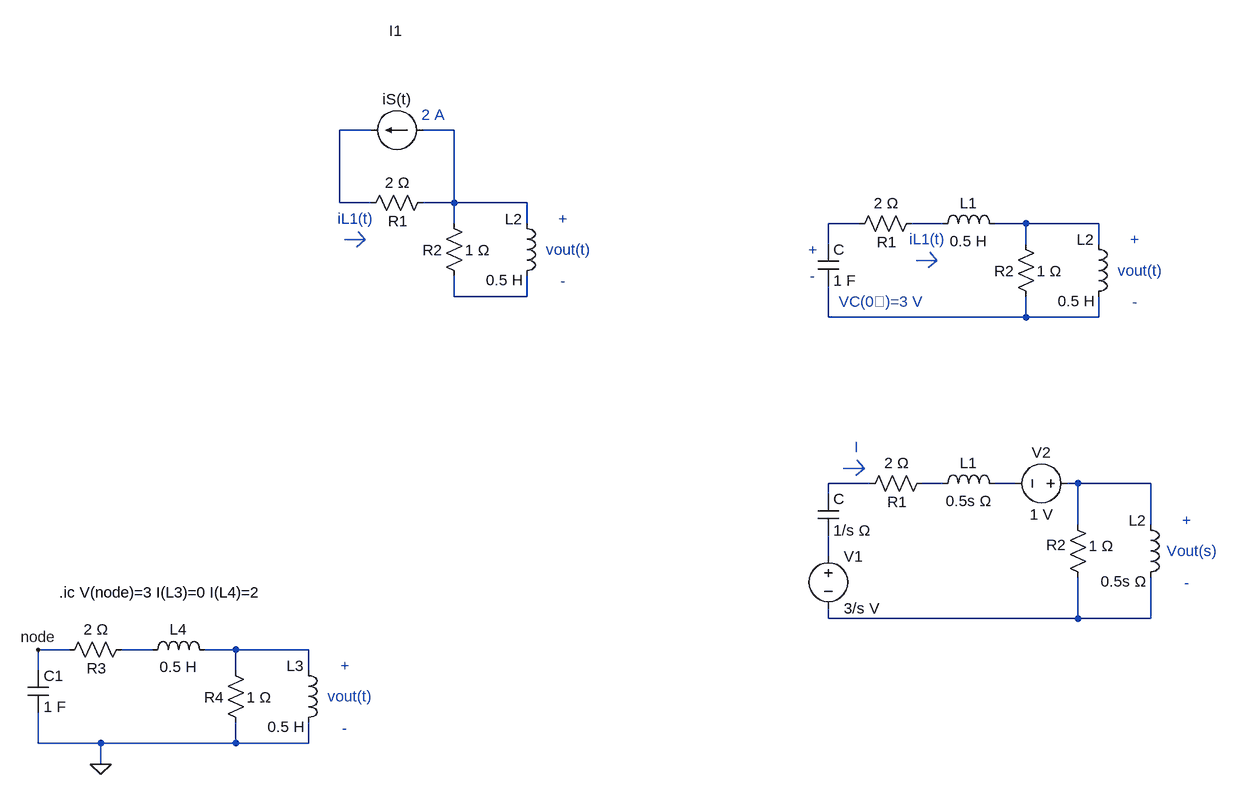
[diagram p0: schematic ELE228-2.asc]
ELE228-2.asc, the LTspice schematic file:
Version 4.1
SHEET 1 1548 1108
WIRE 240 112 192 112
WIRE 368 112 320 112
WIRE 192 224 192 112
WIRE 240 224 192 224
WIRE 368 224 368 112
WIRE 368 224 320 224
WIRE 480 224 368 224
WIRE 368 256 368 224
WIRE 480 256 480 224
WIRE 992 256 944 256
WIRE 1120 256 1072 256
WIRE 1248 256 1200 256
WIRE 1360 256 1248 256
WIRE 944 288 944 256
WIRE 1248 288 1248 256
WIRE 1360 288 1360 256
WIRE 368 368 368 336
WIRE 480 368 480 336
WIRE 480 368 368 368
WIRE 944 400 944 352
WIRE 1248 400 1248 368
WIRE 1248 400 944 400
WIRE 1360 400 1360 368
WIRE 1360 400 1248 400
WIRE 1008 656 944 656
WIRE 1120 656 1088 656
WIRE 1232 656 1200 656
WIRE 1328 656 1312 656
WIRE 1440 656 1328 656
WIRE 944 672 944 656
WIRE 1328 720 1328 656
WIRE 1440 720 1440 656
WIRE 944 768 944 736
WIRE 944 864 944 848
WIRE 1328 864 1328 800
WIRE 1328 864 944 864
WIRE 1440 864 1440 800
WIRE 1440 864 1328 864
WIRE -224 912 -272 912
WIRE -96 912 -144 912
WIRE 32 912 -16 912
WIRE 144 912 32 912
WIRE -272 944 -272 912
WIRE 32 944 32 912
WIRE 144 944 144 912
WIRE -272 1056 -272 1008
WIRE -176 1056 -272 1056
WIRE 32 1056 32 1024
WIRE 32 1056 -176 1056
WIRE 144 1056 144 1024
WIRE 144 1056 32 1056
WIRE -176 1088 -176 1056
FLAG -176 1088 0
FLAG -272 912 node
SYMBOL current 320 112 R90
WINDOW 0 -137 42 VBottom 2
WINDOW 3 -63 40 VTop 2
SYMATTR InstName I1
SYMATTR Value iS(t)
SYMBOL res 336 208 R90
WINDOW 0 60 54 VBottom 2
WINDOW 3 -31 55 VTop 2
SYMATTR InstName R1
SYMATTR Value 2 Ω
SYMBOL res 352 240 R0
WINDOW 0 -33 57 Left 2
WINDOW 3 71 57 Right 2
SYMATTR InstName R2
SYMATTR Value 1 Ω
SYMBOL ind 464 240 R0
WINDOW 0 -18 9 Left 2
WINDOW 3 -47 103 Left 2
SYMATTR InstName L2
SYMATTR Value 0.5 H
SYMBOL res 1088 240 R90
WINDOW 0 60 54 VBottom 2
WINDOW 3 -31 55 VTop 2
SYMATTR InstName R1
SYMATTR Value 2 Ω
SYMBOL res 1232 272 R0
WINDOW 0 -33 57 Left 2
WINDOW 3 71 57 Right 2
SYMATTR InstName R2
SYMATTR Value 1 Ω
SYMBOL ind 1344 272 R0
WINDOW 0 -18 9 Left 2
WINDOW 3 -47 103 Left 2
SYMATTR InstName L2
SYMATTR Value 0.5 H
SYMBOL ind 1104 272 R270
WINDOW 0 32 56 VTop 2
WINDOW 3 5 56 VBottom 2
SYMATTR InstName L1
SYMATTR Value 0.5 H
SYMBOL cap 928 288 R0
SYMATTR InstName C
SYMATTR Value 1 F
SYMBOL res 1104 640 R90
WINDOW 0 60 54 VBottom 2
WINDOW 3 -31 55 VTop 2
SYMATTR InstName R1
SYMATTR Value 2 Ω
SYMBOL res 1312 704 R0
WINDOW 0 -33 47 Left 2
WINDOW 3 71 48 Right 2
SYMATTR InstName R2
SYMATTR Value 1 Ω
SYMBOL ind 1424 704 R0
WINDOW 0 -18 9 Left 2
WINDOW 3 -61 103 Left 2
SYMATTR InstName L2
SYMATTR Value 0.5s Ω
SYMBOL ind 1104 672 R270
WINDOW 0 32 56 VTop 2
WINDOW 3 5 56 VBottom 2
SYMATTR InstName L1
SYMATTR Value 0.5s Ω
SYMBOL cap 928 672 R0
SYMATTR InstName C
SYMATTR Value 1/s Ω
SYMBOL voltage 944 752 R0
SYMATTR InstName V1
SYMATTR Value 3/s V
SYMBOL voltage 1328 656 R90
WINDOW 0 -32 56 VBottom 2
WINDOW 3 32 56 VTop 2
SYMATTR InstName V2
SYMATTR Value 1 V
SYMBOL res -128 896 R90
WINDOW 0 60 54 VBottom 2
WINDOW 3 -31 55 VTop 2
SYMATTR InstName R3
SYMATTR Value 2 Ω
SYMBOL res 16 928 R0
WINDOW 0 -33 57 Left 2
WINDOW 3 71 57 Right 2
SYMATTR InstName R4
SYMATTR Value 1 Ω
SYMBOL ind 128 928 R0
WINDOW 0 -18 9 Left 2
WINDOW 3 -47 103 Left 2
SYMATTR InstName L3
SYMATTR Value 0.5 H
SYMBOL ind -112 928 R270
WINDOW 0 32 56 VTop 2
WINDOW 3 5 56 VBottom 2
SYMATTR InstName L4
SYMATTR Value 0.5 H
SYMBOL cap -288 944 R0
SYMATTR InstName C1
SYMATTR Value 1 F
TEXT 216 248 Center 2 ;iL1(t)
TEXT 336 88 Center 2 ;2 A
TEXT 536 248 Center 2 ;+
TEXT 536 344 Center 2 ;-
TEXT 544 296 Center 2 ;vout(t)
TEXT 1096 280 Center 2 ;iL1(t)
TEXT 1416 280 Center 2 ;+
TEXT 1416 376 Center 2 ;-
TEXT 1424 328 Center 2 ;vout(t)
TEXT 960 376 Left 2 ;VC(0⁻)=3 V
TEXT 920 296 Center 2 ;+
TEXT 920 336 Center 2 ;-
TEXT 1496 712 Center 2 ;+
TEXT 1496 808 Center 2 ;-
TEXT 1504 760 Center 2 ;Vout(s)
TEXT 984 600 Left 2 ;I
TEXT 200 936 Center 2 ;+
TEXT 200 1032 Center 2 ;-
TEXT 208 984 Center 2 ;vout(t)
TEXT -240 824 Left 2 !.ic V(node)=3 I(L3)=0 I(L4)=2
LINE Normal 231 281 199 281
LINE Normal 220 268 231 281
LINE Normal 231 281 220 268
LINE Normal 231 281 218 292
LINE Normal 1111 313 1079 313
LINE Normal 1100 300 1111 313
LINE Normal 1111 313 1100 300
LINE Normal 1111 313 1098 324
LINE Normal 999 633 967 633
LINE Normal 988 620 999 633
LINE Normal 999 633 988 620
LINE Normal 999 633 986 644

The netlist it stands for:
* ELE228-2.asc
I1 N002 N001 iS(t)
R1 N002 N001 2 Ω
R2 N002 N006 1 Ω
L2 N002 N006 0.5 H
R1 N004 N003 2 Ω
R2 N005 N007 1 Ω
L2 N005 N007 0.5 H
L1 N004 N005 0.5 H
C N003 N007 1 F
R1 N009 N008 2 Ω
R2 N011 N013 1 Ω
L2 N011 N013 0.5s Ω
L1 N009 N010 0.5s Ω
C N008 N012 1/s Ω
V1 N012 N013 3/s V
V2 N011 N010 1 V
R3 N014 node 2 Ω
R4 N015 0 1 Ω
L3 N015 0 0.5 H
L4 N014 N015 0.5 H
C1 node 0 1 F
* iL1(t)
* 2 A
* +
* -
* vout(t)
* iL1(t)
* +
* -
* vout(t)
* VC(0⁻)=3 V
* +
* -
* +
* -
* Vout(s)
* I
* +
* -
* vout(t)
.ic V(node)=3 I(L3)=0 I(L4)=2
.backanno
.end